# EAGLE design Roland_140_ADSR_slim (EAGLE 7.6.0)
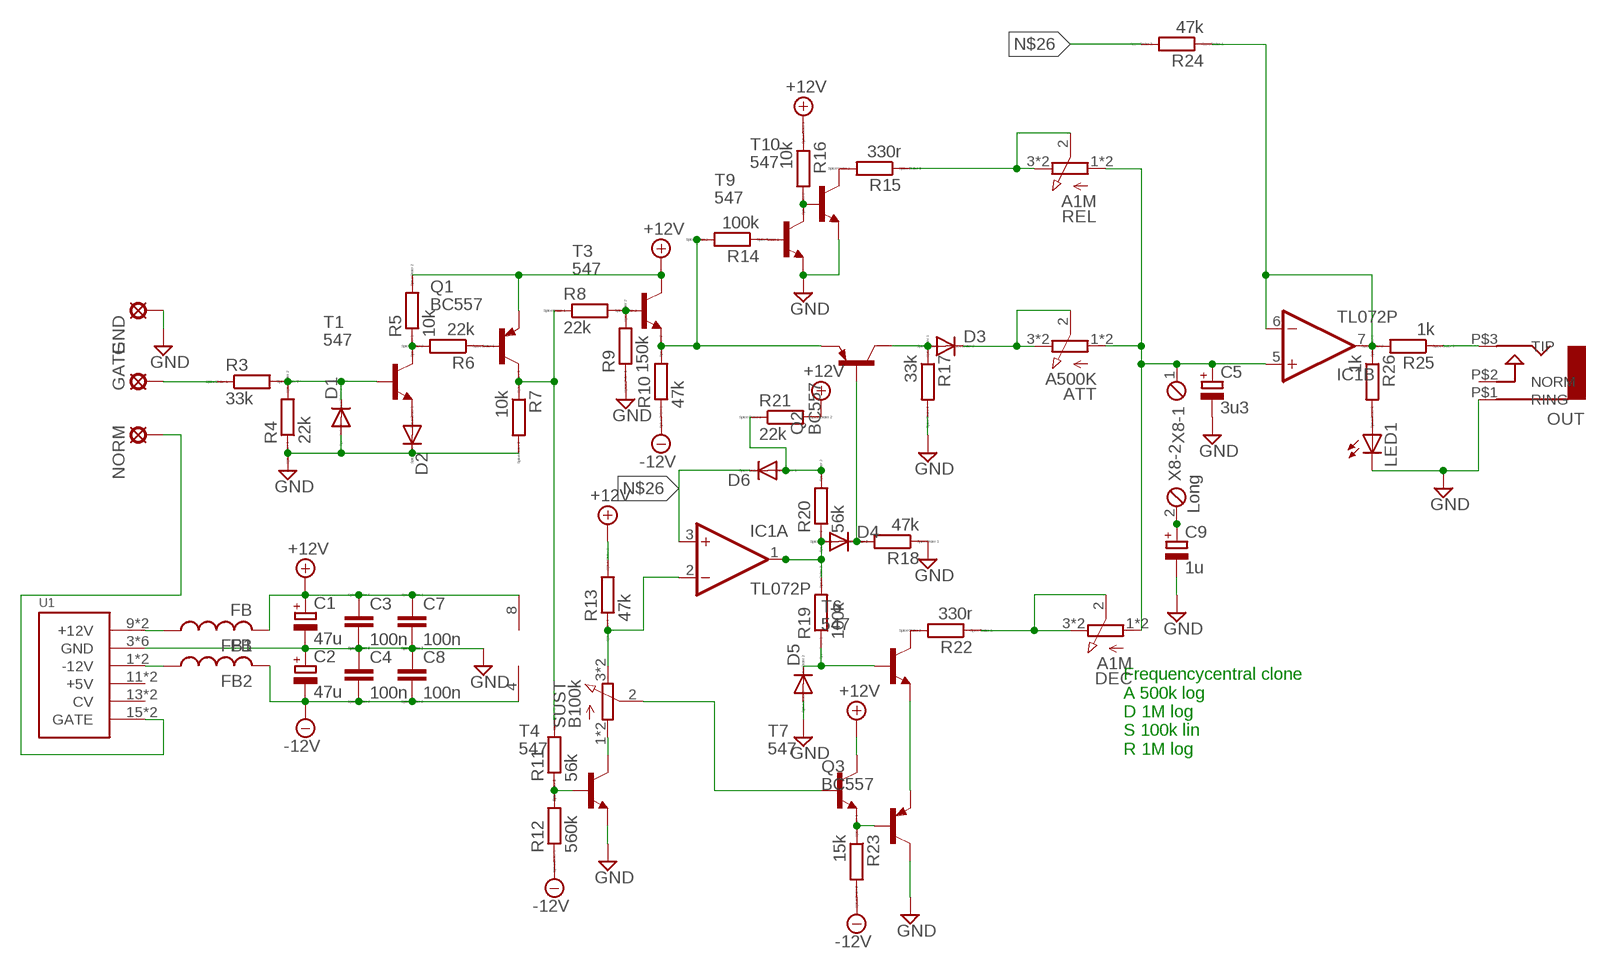
[diagram p0: schematic, sheet 1]

## Parts
ATT  A500K  3RP/1610N  [3RP/1610N]
C1  47u  CPOL-EUE2.5-7  [E2,5-7]
C2  47u  CPOL-EUE2.5-7  [E2,5-7]
C3  100n  C-EU025-025X050  [C025-025X050]
C4  100n  C-EU025-025X050  [C025-025X050]
C5  3u3  CPOL-EUE2.5-6  [E2,5-6]
C7  100n  C-EUC1206K  [C1206K]
C8  100n  C-EUC1206K  [C1206K]
C9  1u  CPOL-EUE2.5-6  [E2,5-6]
D1  1N4148DO35-7  [DO35-7]
D2  1N4148DO35-7  [DO35-7]
D3  1N4148DO35-7  [DO35-7]
D4  1N4148DO35-7  [DO35-7]
D5  1N4148DO35-7  [DO35-7]
D6  1N4148DO35-7  [DO35-7]
DEC  A1M  3RP/1610N  [3RP/1610N]
FB1  FB  [FB]
FB2  FB  [FB]
GATE  LSP10  [LSP10]
GND  LSP10  [LSP10]
IC1  TL072P  [DIL08]
LED1  LED3MM  [LED3MM]
NORM  LSP10  [LSP10]
OUT  AUDIO-JACKITEAD  [JACK-90DEG-ITEAD]
Q1  BC557  [TO92-EBC]
Q2  BC557  [TO92-EBC]
Q3  BC557  [TO92-EBC]
R3  33k  R-EU_0204_7  [0204/7]
R4  22k  R-EU_0204_7  [0204/7]
R5  10k  R-EU_0204_7  [0204/7]
R6  22k  R-EU_0204_7  [0204/7]
R7  10k  R-EU_0204_7  [0204/7]
R8  22k  R-EU_0204_7  [0204/7]
R9  150k  R-EU_0204_7  [0204/7]
R10  47k  R-EU_0204_7  [0204/7]
R11  56k  R-EU_0204_7  [0204/7]
R12  560k  R-EU_0204_7  [0204/7]
R13  47k  R-EU_0204_7  [0204/7]
R14  100k  R-EU_0204_7  [0204/7]
R15  330r  R-EU_0207_7  [0207/7]
R16  10k  R-EU_0207_7  [0207/7]
R17  33k  R-EU_0204_7  [0204/7]
R18  47k  R-EU_0204_7  [0204/7]
R19  100k  R-EU_0204_7  [0204/7]
R20  56k  R-EU_0204_7  [0204/7]
R21  22k  R-EU_0204_7  [0204/7]
R22  330r  R-EU_0204_7  [0204/7]
R23  15k  R-EU_0204_7  [0204/7]
R24  47k  R-EU_0204_7  [0204/7]
R25  1k  R-EU_0204_7  [0204/7]
R26  1k  R-EU_0204_7  [0204/7]
REL  A1M  3RP/1610N  [3RP/1610N]
SUST  B100k  3RP/1610N  [3RP/1610N]
T1  547  BC547-NPN-TO92-CBE  [TO92-CBE]
T3  547  BC547-NPN-TO92-CBE  [TO92-CBE]
T4  547  BC547-NPN-TO92-CBE  [TO92-CBE]
T6  547  BC547-NPN-TO92-CBE  [TO92-CBE]
T7  547  BC547-NPN-TO92-CBE  [TO92-CBE]
T9  547  BC547-NPN-TO92-CBE  [TO92-CBE]
T10  547  BC547-NPN-TO92-CBE  [TO92-CBE]
U1  POWER  [POWER_16]
X8  Long  MPT2  [2POL254]

## Nets
+12V: C1.+ C3.1 C7.1 FB1.P$2 IC1.8(P:V+) Q1.E R5.2 R13.2 R16.1 R21.2 T3.C T7.C
-12V: C2.- C4.2 C8.2 FB2.P$2 IC1.4(P:V-) R10.1 R12.1 R23.2
GND: C1.- C2.+ C3.2 C4.1 C5.- C7.2 C8.1 C9.- D1.A D2.C D5.A GND.MP LED1.K(C) OUT.P$1(RING) Q3.C R4.1 R7.2 R9.1 R17.2 R18.1 T4.E T9.E T10.E U1.3(GND) U1.4(GND) U1.5(GND) U1.6(GND) U1.7(GND) U1.8(GND)
N$1: OUT.P$3(TIP) R25.1
N$2: R14.1 T9.B
N$3: R16.2 T9.C T10.B
N$4: R15.2 T10.C
N$5: R15.1 REL.2(S) REL.3(E) REL.6(E)
N$6: SUST.1(A) SUST.4(A) T4.C
N$7: D3.A Q2.C R17.1
N$8: D4.C Q2.B R18.2
N$9: D1.C R3.2 R4.2 T1.B
N$10: Q1.B R6.1
N$11: R5.1 R6.2 T1.C
N$12: R11.1 R12.2 T4.B
N$13: NORM.MP U1.15(GATE) U1.16(GATE)
N$14: IC1.2(A:-IN) R13.1 SUST.3(E) SUST.6(E)
N$15: D6.A R20.2 R21.1
N$16: D2.A T1.E
N$17: Q1.C R7.1 R8.1 R11.2
N$18: D4.A IC1.1(A:OUT) R19.2 R20.1
N$19: R8.2 R9.2 T3.B
N$20: Q2.E R10.2 R14.2 T3.E
N$21: D5.C R19.1 T6.B
N$22: R22.2 T6.C
N$23: Q3.E T6.E
N$24: Q3.B R23.1 T7.E
N$25: SUST.2(S) T7.B
N$26: D6.C IC1.3(A:+IN) R24.2
N$27: LED1.A R26.2
N$28: ATT.2(S) ATT.3(E) ATT.6(E) D3.C
N$29: DEC.2(S) DEC.3(E) DEC.6(E) R22.1
N$30: ATT.1(A) ATT.4(A) C5.+ DEC.1(A) DEC.4(A) IC1.5(B:+IN) REL.1(A) REL.4(A) X8.1
N$31: IC1.6(B:-IN) IC1.7(B:OUT) R24.1 R25.2 R26.1
N$32: GATE.MP R3.1
N$37: C9.+ X8.2
N$61: FB1.P$1 U1.9(+12V) U1.10(+12V)
N$62: FB2.P$1 U1.1(-12V) U1.2(-12V)
Unconnected: OUT.P$2(NORM) U1.11(+5V) U1.12(+5V) U1.13(CV) U1.14(CV)

## Notes on the sheet
- Frequencycentral clone
  A 500k log
  D 1M log
  S 100k lin
  R 1M log

## Library data of the parts
ATT DEC REL SUST = pot:3RP/1610N: 16mm Potentiometer one level Source: http://www.alphapotentiometers.net/html/16mm_pot_2.html
C1 C2 C5 C9 = resistor:CPOL-EU: POLARIZED CAPACITOR, European symbol
C3 C4 C7 C8 = resistor:C-EU: CAPACITOR, European symbol; SPICEPREFIX: C
D1-D6 = diode:1N4148: DIODE high speed (Philips)
FB1 FB2 = adafruit:FB: Ferrite bead Digikey #P9821BK-ND
GATE GND NORM = solpad:LSP10: SOLDER PAD drill 1.0 mm, distributor Buerklin, 12H555
IC1 = gm-ics:TL072: OP AMP
LED1 = led:LED: LED OSRAM: - CHIPLED LG R971, LG N971, LY N971, LG Q971, LY Q971, LO R971, LY R971 LH N974, LH R974 LS Q976, LO Q976, LY Q976 LO Q996 - Hyper CHIPLED LW Q18S LB Q993, LB Q99A, LB R99A - SideLED LS A670, LO A670, LY A670, LG A670, LP A670 LB A673, LV A673, LT A673, LW A673 LH A674 LY A675 LS A676, LA A676, LO A676, LY A676, LW A676 LS A679, LY A679, LG A679 - Hyper Micro SIDELED® LS Y876, LA Y876, LO Y876, LY Y876 LT Y87S - SmartLED LW L88C, LW L88S LB L89C, LB L89S, LG L890 LS L89K, LO L89K, LY L89K LS L896, LA L896, LO L896, LY L896 - TOPLED LS T670, LO T670, LY T670, LG T670, LP T670 LSG T670, LSP T670, LSY T670, LOP T670, LYG T670 LG T671, LOG T671, LSG T671 LB T673, LV T673, LT T673, LW T673 LH T674 LS T676, LA T676, LO T676, LY T676, LB T676, LH T676, LSB T676, LW T676 LB T67C, LV T67C, LT T67C, LS T67K, LO T67K, LY T67K, LW E67C LS E67B, LA E67B, LO E67B, LY E67B, LB E67C, LV E67C, LT E67C LW T67C LS T679, LY T679, LG T679 LS T770, LO T770, LY T770, LG T770, LP T770 LB T773, LV T773, LT T773, LW T773 LH T774 LS E675, LA E675, LY E675, LS T675 LS T776, LA T776, LO T776, LY T776, LB T776 LHGB T686 LT T68C, LB T68C - Hyper Mini TOPLED® LB M676 - Mini TOPLED Santana® LG M470 LS M47K, LO M47K, LY M47K Source: http://www.osram.convergy.de LUXEON: - LUMILED® LXK2-PW12-R00, LXK2-PW12-S00, LXK2-PW14-U00, LXK2-PW14-V00 LXK2-PM12-R00, LXK2-PM12-S00, LXK2-PM14-U00 LXK2-PE12-Q00, LXK2-PE12-R00, LXK2-PE12-S00, LXK2-PE14-T00, LXK2-PE14-U00 LXK2-PB12-K00, LXK2-PB12-L00, LXK2-PB12-M00, LXK2-PB14-N00, LXK2-PB14-P00, LXK2-PB14-Q00 LXK2-PR12-L00, LXK2-PR12-M00, LXK2-PR14-Q00, LXK2-PR14-R00 LXK2-PD12-Q00, LXK2-PD12-R00, LXK2-PD12-S00 LXK2-PH12-R00, LXK2-PH12-S00 LXK2-PL12-P00, LXK2-PL12-Q00, LXK2-PL12-R00 Source: www.luxeon.com KINGBRIGHT: KA-3528ASYC Source: www.kingbright.com
OUT = erthenvar:AUDIO-JACK: Switching Mono 3.5mm Audio Jack from Erthenvar.
Q1-Q3 = transistor-pnp:BC557*: PNP Transistror
R3-R26 = resistor:R-EU_: RESISTOR, European symbol; SPICEPREFIX: R
T1 T3 T4 T6 T7 T9 T10 = transistor:*-NPN-: NPN Transistror BF959 corrected 2008.03.06
U1 = eurorack:POWER
X8 = con-phoenix-254:MPT2: PHOENIX CONNECTOR; OC_FARNELL: unknown; OC_NEWARK: unknown

## Board
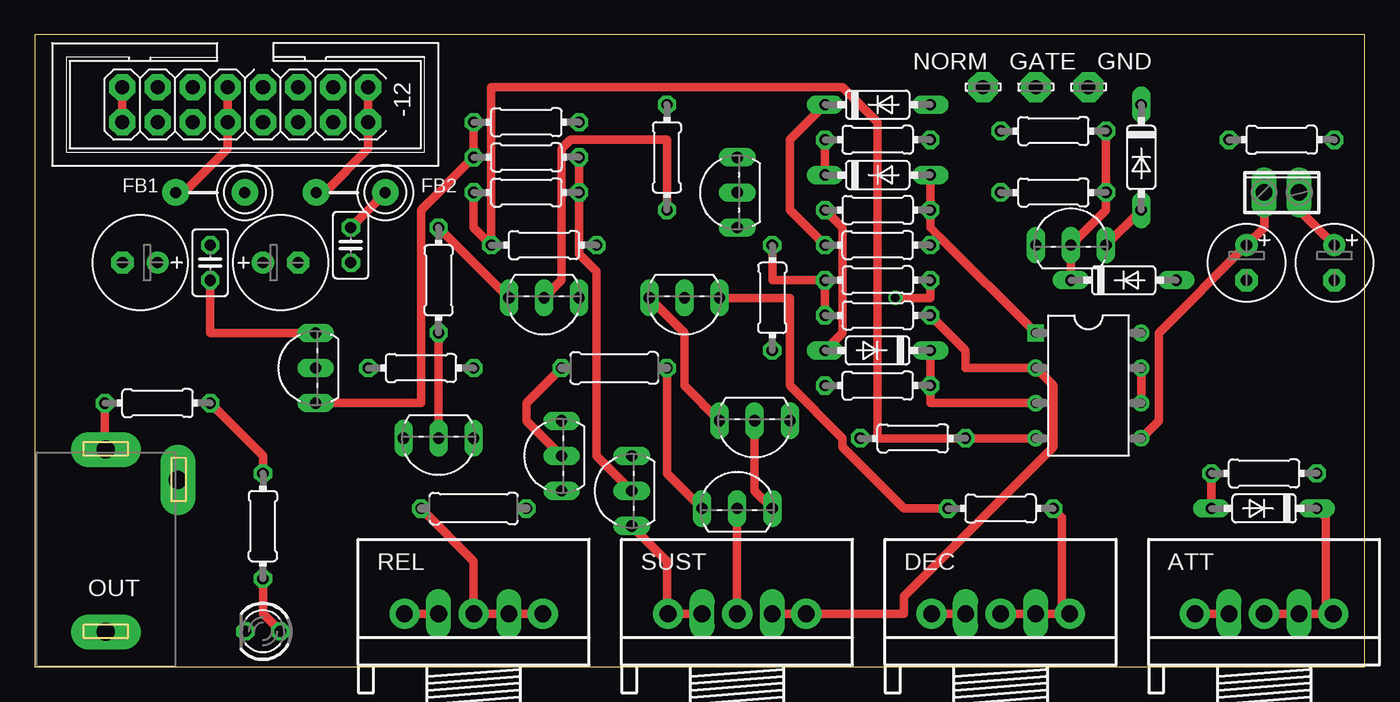
[diagram p1: board, top side]
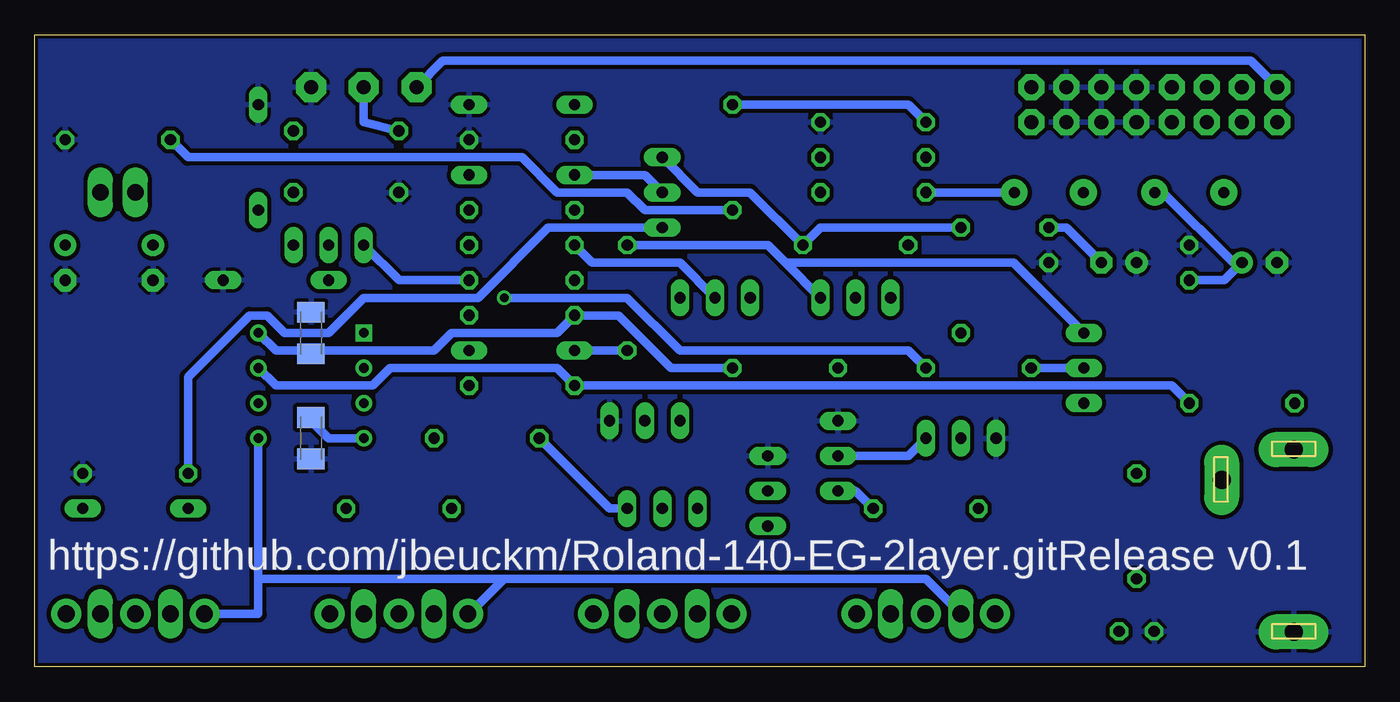
[diagram p2: board, bottom side, seen from below]

Size 96.19 x 45.71 mm. Coordinates in mm from the lower left corner, seen from the top.
Outline: 0,0 96.19,0 96.19,45.71 0,45.71 0,0
Copper layers (1*16): Top 0.035mm / dielectric 1.5mm / Bottom 0.035mm
Design rules "default *": minimum track width 24mil, minimum drill 24mil, track to track 12mil, track to pad 12mil, pad to pad 12mil, via to via 12mil, smd to smd 8mil, copper to edge 10mil, drill to drill 8mil, minimum pad ring 10mil, minimum via ring 8mil, stop-mask expansion 4mil, vias tented up to drill 0mil, thermal gap 10mil

### Footprints (pad centres in the part's own frame; a part is rotated, then mirrored left to right if it is on the bottom)
3RP/1610N = drill 1.2 pad 2.184: 1 -5,0; 2 0,0; 3 5,0 | drill 1.2 long: 4 -2.54,0; 6 2.54,0
E2,5-7 = drill 0.813 pad 1.6: + -1.27,0 | drill 0.813 pad 1.6 octagon: - 1.27,0
C025-025X050 = drill 0.813 octagon: 1 -1.27,0; 2 1.27,0
E2,5-6 = drill 0.813 pad 1.6: + -1.27,0 | drill 0.813 pad 1.6 octagon: - 1.27,0
C1206K = smd 1.5 x 2: 1 -1.5,0; 2 1.5,0
DO35-7 = drill 0.813 long: A 3.81,0; C -3.81,0
FB = drill 0.8 pad 1.93: P$1 -2.5,0; P$2 2.5,0
LSP10 = drill 1.016 pad 2.159 octagon: MP 0,0
DIL08 = drill 0.7 square: 1 -3.81,-3.81 | drill 0.7: 2 -1.27,-3.81; 3 1.27,-3.81; 4 3.81,-3.81; 5 3.81,3.81; 6 1.27,3.81; 7 -1.27,3.81; 8 -3.81,3.81
LED3MM = drill 0.813 octagon: A -1.27,0; K 1.27,0
JACK-90DEG-ITEAD = drill 1.3 pad 2.54 long: P$1 5,-2.5; P$2 -0.2,-13.5; P$3 5,-15.7
TO92-EBC = drill 0.813 long: B 0,-1.27; C -2.54,-1.27; E 2.54,-1.27
0204/7 = drill 0.813 octagon: 1 -3.81,0; 2 3.81,0
0207/7 = drill 0.813 octagon: 1 -3.81,0; 2 3.81,0
TO92-CBE = drill 0.813 long: B 0,0; C -2.54,0; E 2.54,0
POWER_16 = drill 1.016 pad 1.88 octagon: 1 -6.35,-1.27; 2 -6.35,1.27; 3 -3.81,-1.27; 4 -3.81,1.27; 5 -1.27,-1.27; 6 -1.27,1.27; 7 1.27,-1.27; 8 1.27,1.27; 9 3.81,-1.27; 10 3.81,1.27; 11 6.35,-1.27; 12 6.35,1.27; 13 8.89,-1.27; 14 8.89,1.27; 15 11.43,-1.27; 16 11.43,1.27
2POL254 = drill 1.2 long: 1 -1.27,0; 2 1.27,0

### Placement (x,y rotation side)
ATT  88.9,3.81 0 top
C1  7.62,29.21 180 top
C2  17.78,29.21 0 top
C3  12.7,29.21 90 top
C4  22.86,30.48 90 top
C5  87.63,29.21 270 top
C7  76.2,24.13 90 bottom
C8  76.2,16.51 90 bottom
C9  93.98,29.21 270 top
D1  78.74,27.94 0 top
D2  80.01,36.83 270 top
D3  88.9,11.43 180 top
D4  60.96,35.56 0 top
D5  60.96,40.64 0 top
D6  60.96,22.86 180 top
DEC  69.85,3.81 0 top
FB1  12.7,34.29 0 top
FB2  22.86,34.29 0 top
GATE  72.39,41.91 0 top
GND  76.2,41.91 0 top
IC1  76.2,20.32 270 top
LED1  16.51,2.54 180 top
NORM  68.58,41.91 0 top
OUT  10.16,0 180 top
Q1  19.05,21.59 90 top
Q2  49.53,34.29 90 top
Q3  52.07,16.51 180 top
R3  73.66,38.73 0 top
R4  73.66,34.29 0 top
R5  60.96,27.94 180 top
R6  27.94,21.59 0 top
R7  35.56,39.37 0 top
R8  45.72,36.83 270 top
R9  90.17,38.1 180 top
R10  36.83,30.48 0 top
R11  35.56,36.83 180 top
R12  35.56,34.29 0 top
R13  60.96,25.4 180 top
R14  29.21,27.94 90 top
R15  31.75,11.43 0 top
R16  41.91,21.59 180 top
R17  88.9,13.97 0 top
R18  60.96,38.1 180 top
R19  60.96,30.48 0 top
R20  60.96,33.02 180 top
R21  53.34,26.67 90 top
R22  69.85,11.43 180 top
R23  63.5,16.51 0 top
R24  60.96,20.32 0 top
R25  8.89,19.05 0 top
R26  16.51,10.16 270 top
REL  31.75,3.81 0 top
SUST  50.8,3.81 0 top
T1  74.93,30.48 0 top
T3  36.83,26.67 180 top
T4  43.18,12.7 90 top
T6  46.99,26.67 180 top
T7  50.8,11.43 0 top
T9  29.21,16.51 180 top
T10  38.1,15.24 90 top
U1  17.78,40.64 180 top
X8  90.17,34.29 0 top

### Tracks (layer width: path | path; a pad name or v marks a point on that pad's centre or on a via)
+12V
  Top 0.61: Q1.E 12.7,24.13 C3.1 | T7.C 45.72,13.97 R16.1 | R13.2 R5.2 53.34,27.94 R21.2
  Bottom 0.61: C3.1 10.16,27.94 C1.+ 9.53,29.21 14.61,34.29 FB1.P$2 | 76.2,22.86 78.74,22.86 IC1.8 | 41.91,29.21 43.18,30.48 R21.2 | 41.91,29.21 T3.C | 76.2,22.86 67.31,22.86 66.04,24.13 58.42,24.13 R13.2 53.98,25.4 50.16,21.59 R16.1 | 76.2,22.86 C7.1 | Q1.E 25.4,29.21 41.91,29.21
-12V
  Top 0.61: IC1.4 R23.2 60.96,16.51 60.96,39.37 58.42,41.91 33.02,41.91 R10.1 31.75,31.75 R12.1 | C4.2 24.77,33.66 24.77,34.29 FB2.P$2
  Bottom 0.61: IC1.4 74.93,16.51 76.2,17.78 C8.2 | C2.- 21.59,31.75 C4.2 | FB2.P$2 R12.1
GND
  pour Bottom: -1.27,46.99 100.33,46.99 100.33,-1.27 -1.27,-1.27
N$1
  Top 0.61: R25.1 5.08,15.88 OUT.P$3
N$2
  Top 0.61: R14.1 T9.B
N$3
  Top 0.61: R16.2 35.56,19.05 35.56,17.78 T10.B
  Bottom 0.61: T9.C 33.02,15.24 T10.B
N$4
  Bottom 0.61: R15.2 36.83,12.7 T10.C
N$5
  Top 0.61: REL.3 REL.6 REL.2 31.75,7.62 R15.1
N$6
  Top 0.61: T4.C 45.72,7.62 45.72,3.81 SUST.1 SUST.4
N$7
  Top 0.61: R17.1 D3.A
  Bottom 0.61: Q2.C 59.05,31.75 64.14,26.67 72.39,26.67 74.93,24.13 78.11,24.13 79.38,25.4 80.64,25.4 85.09,20.95 R17.1
N$8
  Top 0.61: D4.C R18.2
  Bottom 0.61: Q2.B 52.07,35.56 D4.C
N$9
  Top 0.61: D1.C T1.B 77.47,33.02 R4.2 R3.2
N$10
  Bottom 0.61: R6.1 Q1.B
N$11  (via drill 0.61)
  Top 0.61: v62.23,26.67 64.77,26.67 R5.1
  Bottom 0.61: R6.2 33.02,22.86 49.53,22.86 53.34,26.67 v62.23,26.67 | T1.C 69.85,27.94 R5.1
N$12
  Top 0.61: T4.B 40.64,15.24 40.64,28.57 39.37,29.84 R12.2 R11.1
N$13
  Top 0.61: U1.15 U1.16
  Bottom 0.61: NORM.MP 66.67,43.81 8.26,43.81 U1.15
N$14
  Top 0.61: SUST.6 SUST.3 62.87,3.81 62.87,5.08 73.66,15.88 73.66,20.32 IC1.2 67.31,21.59 67.31,22.86 R13.1
N$15
  Top 0.61: R20.2 58.42,31.75 58.42,24.13 D6.A
  Bottom 0.61: D6.A R21.1
N$16
  Top 0.61: D2.A T1.E
N$17
  Top 0.61: Q1.C 27.94,19.05 27.94,33.02 R11.2 R7.1
  Bottom 0.61: R8.1 33.02,40.64 R7.1
N$18
  Top 0.61: 65.41,31.11 64.77,31.75 R20.1 D4.A | 65.41,31.11 IC1.1 | 65.41,31.11 R19.2
N$19
  Top 0.61: T3.B 38.1,27.94 38.1,37.47 38.73,38.1 45.72,38.1 R8.2
  Bottom 0.61: R9.2 85.09,36.83 60.96,36.83 58.42,34.29 53.34,34.29 52.07,33.02 R8.2
N$20
  Top 0.61: T3.E R14.2
  Bottom 0.61: R14.2 39.37,31.75 R10.2 44.45,34.29 48.26,34.29 Q2.E
N$21
  Top 0.61: D5.C 54.61,38.1 54.61,33.02 R19.1
  Bottom 0.61: T6.B 49.53,29.21 55.88,29.21 R19.1
N$22
  Top 0.61: T6.C 54.61,26.67 54.61,20.32 58.42,16.51 58.42,15.88 62.87,11.43 R22.2
N$23
  Top 0.61: Q3.E 46.99,20.32 46.99,24.13 T6.E
N$24
  Top 0.61: T7.E 52.07,12.7 Q3.B
  Bottom 0.61: R23.1 54.61,11.43 T7.E
N$25
  Top 0.61: SUST.2 T7.B
N$26
  Top 0.61: IC1.3 64.77,19.05 R24.2 D6.C
N$27
  Top 0.61: LED1.A 16.51,3.81 R26.2
N$28
  Top 0.61: D3.C 93.34,10.79 93.34,3.81 | 93.34,3.81 ATT.6 ATT.2 | 93.34,3.81 ATT.3
N$29
  Top 0.61: R22.1 74.3,10.79 74.3,3.81 | 74.3,3.81 DEC.6 DEC.2 | 74.3,3.81 DEC.3
N$30
  Top 0.61: X8.1 88.9,31.75 C5.+ 81.28,24.13 81.28,17.78 IC1.5 | ATT.1 ATT.4 | REL.1 REL.4 | DEC.1 DEC.4
  Bottom 0.61: 80.01,6.35 80.01,3.81 ATT.1 | 80.01,6.35 IC1.5 | REL.4 31.75,6.35 62.23,6.35 | 62.23,6.35 64.77,3.81 DEC.1 | 62.23,6.35 80.01,6.35
N$31
  Top 0.61: R25.2 16.51,15.24 R26.1 | IC1.7 IC1.6
  Bottom 0.61: IC1.7 78.74,20.32 71.75,20.32 70.48,21.59 58.42,21.59 R24.1 13.97,20.32 R25.2
N$32
  Bottom 0.61: R3.1 72.39,39.37 GATE.MP
N$37
  Top 0.61: C9.+ 91.44,33.02 X8.2
N$61
  Top 0.61: U1.9 U1.10 13.97,37.47 10.79,34.29 FB1.P$1
N$62
  Top 0.61: U1.1 U1.2 24.13,37.47 20.95,34.29 FB2.P$1

### Text on the board
bNames: Release v0.1 | https://github.com/jbeuckm/Roland-140-EG-2layer.git